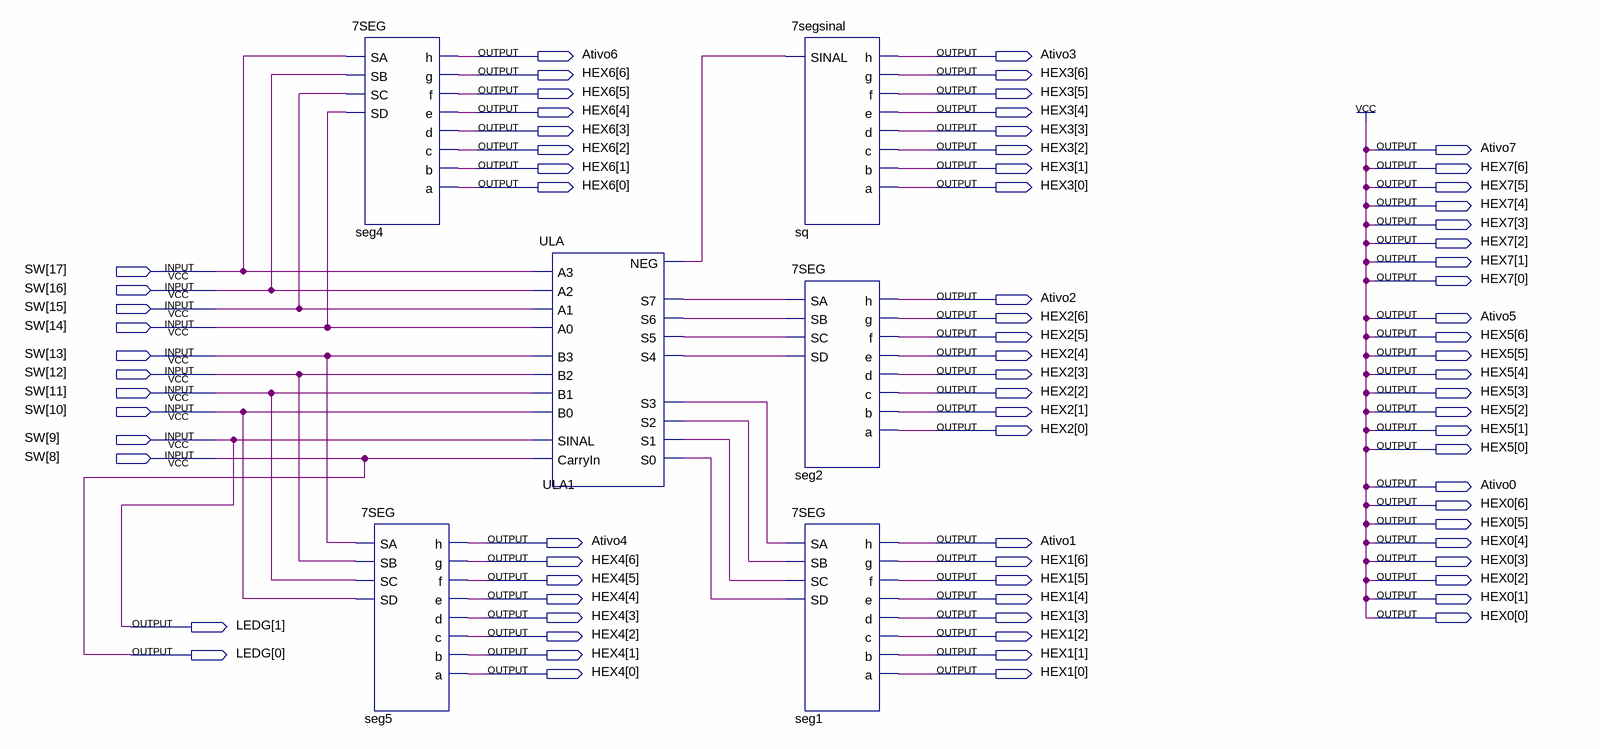
[diagram p0: schematic sheet]
// Quartus schematic TrabalhoFinal.bdf as structural Verilog: 6 symbols, 76 pins
module TrabalhoFinal (
  input  [17:8] SW,
  output Ativo6,
  output Ativo3,
  output [6:0] HEX6,
  output [6:0] HEX3,
  output Ativo7,
  output [6:0] HEX7,
  output Ativo2,
  output [6:0] HEX2,
  output Ativo5,
  output [6:0] HEX5,
  output Ativo0,
  output [6:0] HEX0,
  output Ativo4,
  output Ativo1,
  output [6:0] HEX4,
  output [6:0] HEX1,
  output [1:0] LEDG
);

  wire ULA1_neg, ULA1_s0, ULA1_s1, ULA1_s2, ULA1_s3, ULA1_s4, ULA1_s5, ULA1_s6, ULA1_s7;

  \7SEG  seg4 (
    .SA(SW[17]), .SB(SW[16]), .SC(SW[15]), .SD(SW[14]), .h(Ativo6), .g(HEX6[6]), .f(HEX6[5]), .e(HEX6[4]),
    .d(HEX6[3]), .c(HEX6[2]), .b(HEX6[1]), .a(HEX6[0]));
  \7SEG  seg5 (
    .SA(SW[13]), .SB(SW[12]), .SC(SW[11]), .SD(SW[10]), .h(Ativo4), .g(HEX4[6]), .f(HEX4[5]), .e(HEX4[4]),
    .d(HEX4[3]), .c(HEX4[2]), .b(HEX4[1]), .a(HEX4[0]));
  ULA ULA1 (
    .CarryIn(SW[8]), .A3(SW[17]), .A2(SW[16]), .A1(SW[15]), .A0(SW[14]), .B3(SW[13]), .B2(SW[12]),
    .B1(SW[11]), .B0(SW[10]), .SINAL(SW[9]), .NEG(ULA1_neg), .S7(ULA1_s7), .S6(ULA1_s6), .S5(ULA1_s5),
    .S4(ULA1_s4), .S3(ULA1_s3), .S2(ULA1_s2), .S1(ULA1_s1), .S0(ULA1_s0));
  \7segsinal  sq (
    .SINAL(ULA1_neg), .h(Ativo3), .g(HEX3[6]), .f(HEX3[5]), .e(HEX3[4]), .d(HEX3[3]), .c(HEX3[2]),
    .b(HEX3[1]), .a(HEX3[0]));
  \7SEG  seg2 (
    .SA(ULA1_s7), .SB(ULA1_s6), .SC(ULA1_s5), .SD(ULA1_s4), .h(Ativo2), .g(HEX2[6]), .f(HEX2[5]),
    .e(HEX2[4]), .d(HEX2[3]), .c(HEX2[2]), .b(HEX2[1]), .a(HEX2[0]));
  \7SEG  seg1 (
    .SA(ULA1_s3), .SB(ULA1_s2), .SC(ULA1_s1), .SD(ULA1_s0), .h(Ativo1), .g(HEX1[6]), .f(HEX1[5]),
    .e(HEX1[4]), .d(HEX1[3]), .c(HEX1[2]), .b(HEX1[1]), .a(HEX1[0]));

  assign Ativo0 = 1'b1;
  assign Ativo5 = 1'b1;
  assign Ativo7 = 1'b1;
  assign HEX0 = {7{1'b1}};
  assign HEX5 = {7{1'b1}};
  assign HEX7 = {7{1'b1}};
  assign LEDG = SW[9:8];
endmodule
